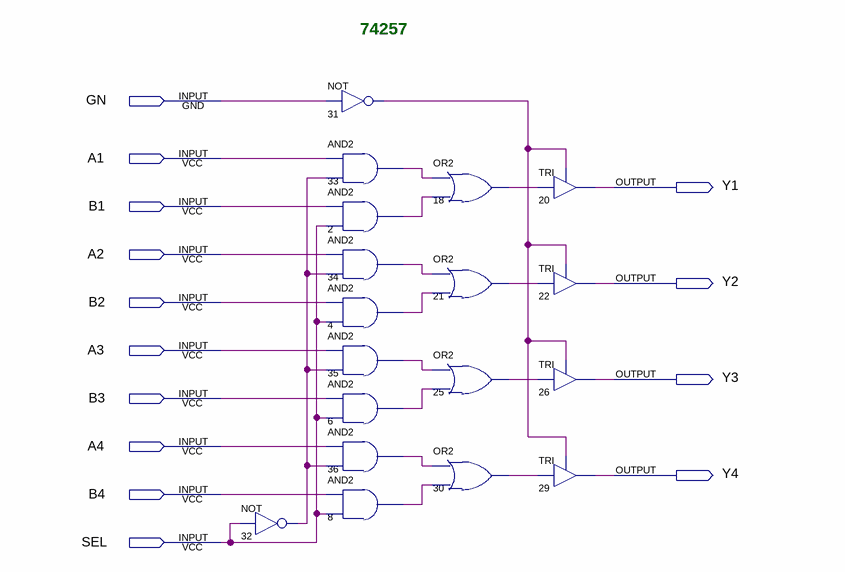
[diagram p0: schematic sheet]
// Quartus schematic 74257.bdf as structural Verilog: 18 symbols, 14 pins
module \74257  (
  input  GN,
  input  A1,
  input  B1,
  input  A2,
  input  B2,
  input  A3,
  input  B3,
  input  A4,
  input  B4,
  input  SEL,
  output Y1,
  output Y2,
  output Y3,
  output Y4
);

  wire n2_out, n4_out, n6_out, n8_out, n18_out, n21_out, n25_out, n30_out, n31_out, n32_out, n33_out,
       n34_out, n35_out, n36_out;

  not u_32 (n32_out, SEL);
  not u_31 (n31_out, GN);
  and u_33 (n33_out, A1, n32_out);
  and u_2 (n2_out, B1, SEL);
  and u_34 (n34_out, A2, n32_out);
  and u_4 (n4_out, B2, SEL);
  and u_35 (n35_out, A3, n32_out);
  and u_6 (n6_out, B3, SEL);
  and u_36 (n36_out, A4, n32_out);
  and u_8 (n8_out, B4, SEL);
  or u_18 (n18_out, n33_out, n2_out);
  or u_21 (n21_out, n34_out, n4_out);
  or u_25 (n25_out, n35_out, n6_out);
  or u_30 (n30_out, n36_out, n8_out);
  TRI u_20 (.IN(n18_out), .OE(n31_out), .OUT(Y1));
  TRI u_22 (.IN(n21_out), .OE(n31_out), .OUT(Y2));
  TRI u_26 (.IN(n25_out), .OE(n31_out), .OUT(Y3));
  TRI u_29 (.IN(n30_out), .OE(n31_out), .OUT(Y4));

  // Notes on the sheet:
  //   74257
endmodule
